# EAGLE design openmv3 (EAGLE 6.1)
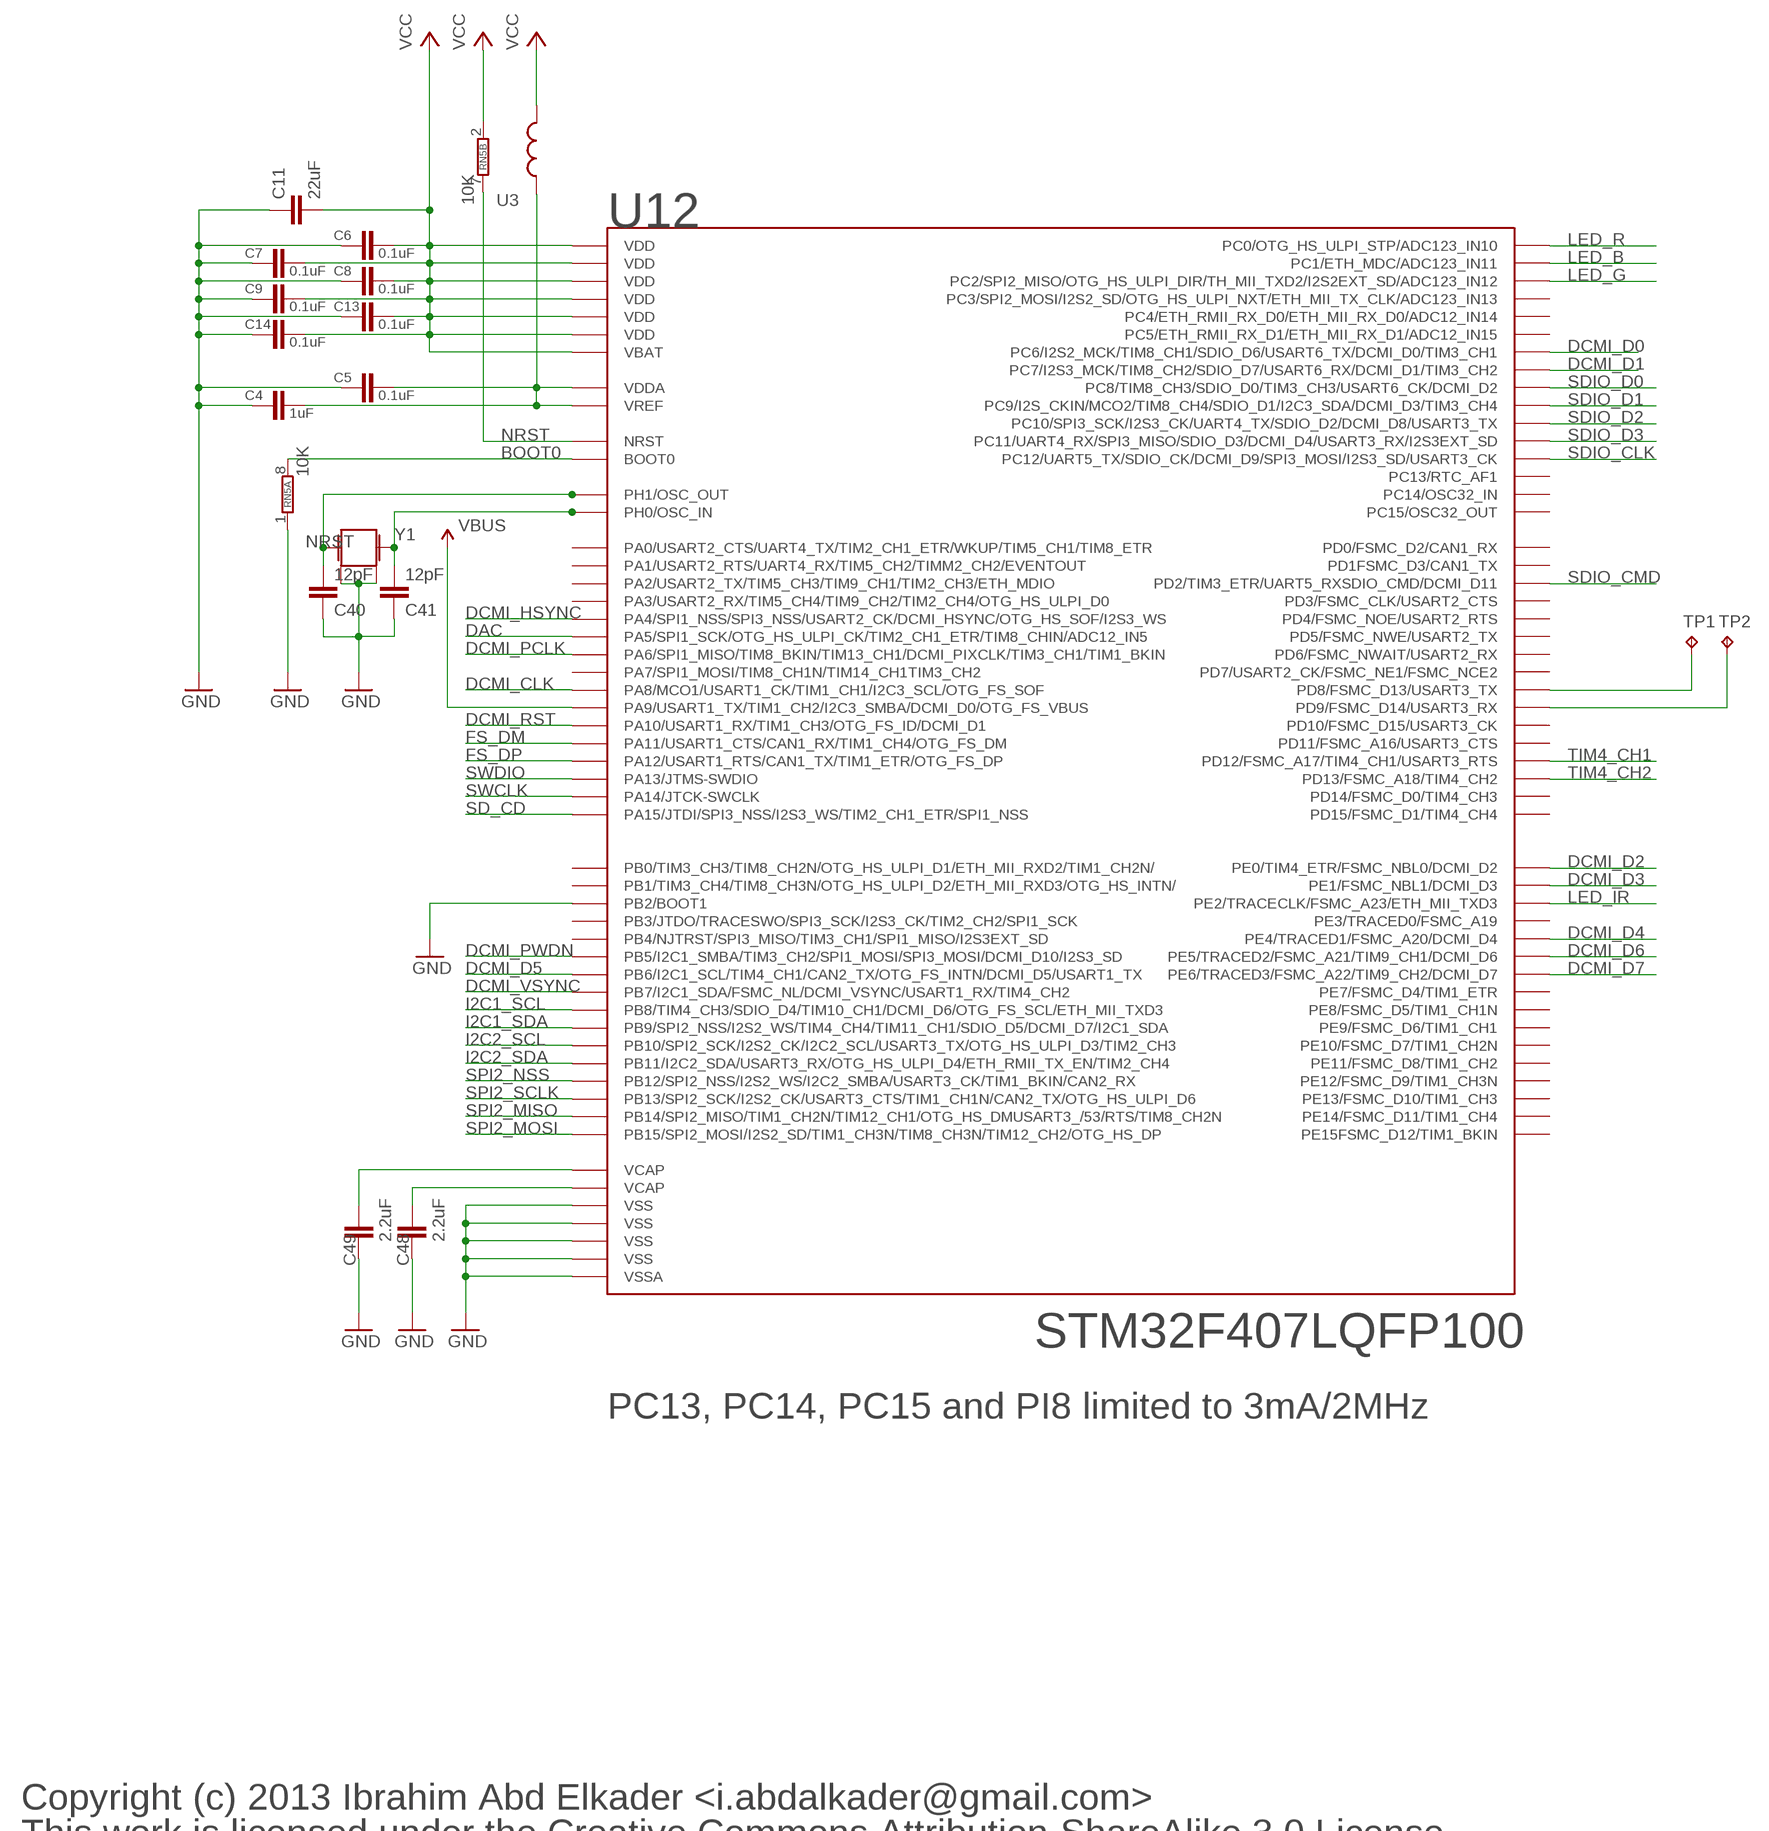
[diagram p0: schematic, sheet 1, part 1 of 2]
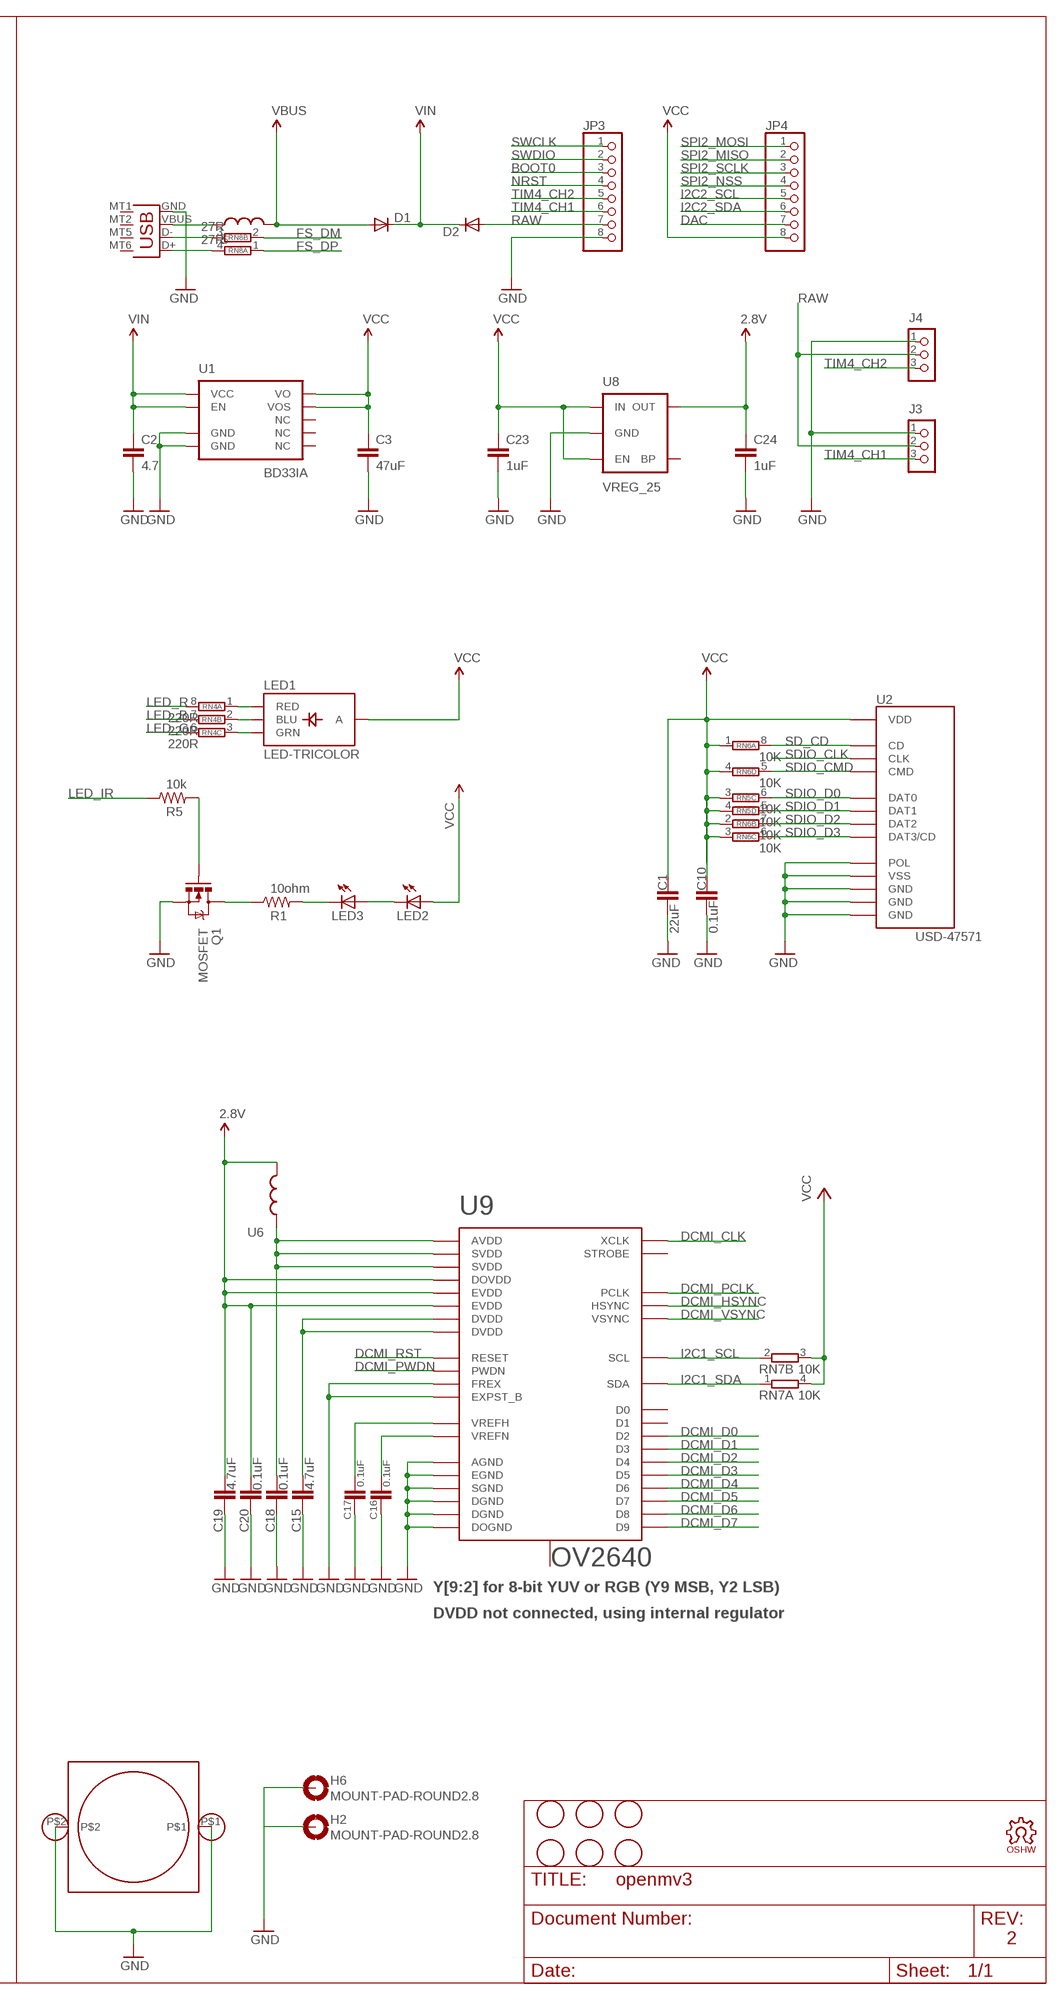
[diagram p1: schematic, sheet 1, part 2 of 2]

## Parts
C1  22uF  CAP0805  [0805]
C2  4.7  CAP0603-CAP  [0603-CAP]
C3  47uF  CAP1206  [1206]
C4  1uF  CAP0603-CAP  [0603-CAP]
C5  0.1uF  CAP0603-CAP  [0603-CAP]
C6  0.1uF  CAP0603-CAP  [0603-CAP]
C7  0.1uF  CAP0603-CAP  [0603-CAP]
C8  0.1uF  CAP0603-CAP  [0603-CAP]
C9  0.1uF  CAP0603-CAP  [0603-CAP]
C10  0.1uF  CAP0603-CAP  [0603-CAP]
C11  22uF  CAP0805  [0805]
C13  0.1uF  CAP0603-CAP  [0603-CAP]
C14  0.1uF  CAP0603-CAP  [0603-CAP]
C15  4.7uF  CAP0603-CAP  [0603-CAP]
C16  0.1uF  CAP0603-CAP  [0603-CAP]
C17  0.1uF  CAP0603-CAP  [0603-CAP]
C18  0.1uF  CAP0603-CAP  [0603-CAP]
C19  4.7uF  CAP0603-CAP  [0603-CAP]
C20  0.1uF  CAP0603-CAP  [0603-CAP]
C23  1uF  CAP0603-CAP  [0603-CAP]
C24  1uF  CAP0603-CAP  [0603-CAP]
C40  12pF  CAP0603-CAP  [0603-CAP]
C41  12pF  CAP0603-CAP  [0603-CAP]
C48  2.2uF  CAP0603-CAP  [0603-CAP]
C49  2.2uF  CAP0603-CAP  [0603-CAP]
D1  DIODESOD  [SOD-323]
D2  DIODESOD  [SOD-323]
H2  MOUNT-PAD-ROUND2.8  [2,8-PAD]
H6  MOUNT-PAD-ROUND2.8  [2,8-PAD]
J3  CON_HEADER_1X03  [M1X3_SMD]
J4  CON_HEADER_1X03  [M1X3_SMD]
JP3  PINHD-1X8  [1X08]
JP4  PINHD-1X8  [1X08]
LED1  LED-TRICOLOR  [LED-TRICOLOR-SMD]
LED2  LED3MM  [LED3MM]
LED3  LED3MM  [LED3MM]
LOGO1  OSHW_LOGO_FILLX0150-NT  [OSHW_FILLX150_NOTEXT]
Q1  MOSFET  MOSFET-NCHANNELSMD  [SOT23-3]
R1  10ohm  RESISTOR0603-RES  [0603-RES]
R5  10k  RESISTOR0603-RES  [0603-RES]
RN4  220R  4R-NEXBV8V  [EXBV8V]
RN5  10K  4R-NEXBV8V  [EXBV8V]
RN6  10K  4R-NEXBV8V  [EXBV8V]
RN7  10K  2R-NEXBV4V  [EXBV4V]
RN8  27R  2R-NEXBV4V  [EXBV4V]
TP1  TPTP12R  [TP12R]
TP2  TPTP12R  [TP12R]
U1  BD33IA  [HTSOP-J8]
U2  USD-47571  [USD-47571]
U3  INDUCTOR0603  [0603]
U6  INDUCTOR0603  [0603]
U7  INDUCTOR0603  [0603]
U8  VREG_25  V_REG_LDOSMD  [SOT23-5]
U9  OV2640  [CSP2]
U12  STM32F407LQFP100  [LQFP100]
U$1  LENSMOUNT20MM  [LENSMOUNT-20MM]
U$14  FIDUCIAL  [FIDUCIAL_1MM]
U$15  FIDUCIAL  [FIDUCIAL_1MM]
U$16  FIDUCIAL  [FIDUCIAL_1MM]
U$17  FIDUCIAL  [FIDUCIAL_1MM]
U$19  FIDUCIAL  [FIDUCIAL_1MM]
U$20  FIDUCIAL  [FIDUCIAL_1MM]
X2  USB-MICROB  [USB-MICROB]
Y1  CRYSTAL2.5X2.0  [CRYSTAL-2.5X2.0]

## Nets
2.8V: C19.1 C20.1 C24.1 U6.2 U8.5(OUT) U9.B1(DOVDD) U9.F1(EVDD) U9.G1(EVDD)
BOOT0: JP3.3 RN5.8 U12.94(BOOT0)
DAC: JP4.7 U12.30(PA5/SPI1_SCK/OTG_HS_ULPI_CK/TIM2_CH1_ETR/TIM8_CHIN/ADC12_IN5)
DCMI_CLK: U9.C4(XCLK) U12.67(PA8/MCO1/USART1_CK/TIM1_CH1/I2C3_SCL/OTG_FS_SOF)
DCMI_D0: U9.F3(D2) U12.63(PC6/I2S2_MCK/TIM8_CH1/SDIO_D6/USART6_TX/DCMI_D0/TIM3_CH1)
DCMI_D1: U9.G3(D3) U12.64(PC7/I2S3_MCK/TIM8_CH2/SDIO_D7/USART6_RX/DCMI_D1/TIM3_CH2)
DCMI_D2: U9.F4(D4) U12.97(PE0/TIM4_ETR/FSMC_NBL0/DCMI_D2)
DCMI_D3: U9.G4(D5) U12.98(PE1/FSMC_NBL1/DCMI_D3)
DCMI_D4: U9.E5(D6) U12.3(PE4/TRACED1/FSMC_A20/DCMI_D4)
DCMI_D5: U9.G5(D7) U12.92(PB6/I2C1_SCL/TIM4_CH1/CAN2_TX/OTG_FS_INTN/DCMI_D5/USART1_TX)
DCMI_D6: U9.F5(D8) U12.4(PE5/TRACED2/FSMC_A21/TIM9_CH1/DCMI_D6)
DCMI_D7: U9.G6(D9) U12.5(PE6/TRACED3/FSMC_A22/TIM9_CH2/DCMI_D7)
DCMI_HSYNC: U9.C3(HSYNC) U12.29(PA4/SPI1_NSS/SPI3_NSS/USART2_CK/DCMI_HSYNC/OTG_HS_SOF/I2S3_WS)
DCMI_PCLK: U9.E3(PCLK) U12.31(PA6/SPI1_MISO/TIM8_BKIN/TIM13_CH1/DCMI_PIXCLK/TIM3_CH1/TIM1_BKIN)
DCMI_PWDN: U9.B6(PWDN) U12.91(PB5/I2C1_SMBA/TIM3_CH2/SPI1_MOSI/SPI3_MOSI/DCMI_D10/I2S3_SD)
DCMI_RST: U9.C6(RESET) U12.69(PA10/USART1_RX/TIM1_CH3/OTG_FS_ID/DCMI_D1)
DCMI_VSYNC: U9.D2(VSYNC) U12.93(PB7/I2C1_SDA/FSMC_NL/DCMI_VSYNC/USART1_RX/TIM4_CH2)
FS_DM: RN8.2 U12.70(PA11/USART1_CTS/CAN1_RX/TIM1_CH4/OTG_FS_DM)
FS_DP: RN8.1 U12.71(PA12/USART1_RTS/CAN1_TX/TIM1_ETR/OTG_FS_DP)
GND: C1.2 C2.2 C3.2 C4.2 C5.2 C6.2 C7.2 C8.2 C9.2 C10.2 C11.1 C13.2 C14.2 C15.2 C16.2 C17.2 C18.2 C19.2 C20.2 C23.2 C24.2 C40.1 C41.1 C48.2 C49.2 H2.B2,8(MOUNT) H6.B2,8(MOUNT) J3.1 J4.1 JP3.8 Q1.2(S) RN5.1 U1.3(GND) U1.P$1(GND) U2.G$1(GND) U2.G$2(GND) U2.G$3(GND) U2.G$4(POL) U2.P$6(VSS) U8.2(GND) U9.A1(DOGND) U9.A2(EXPST_B) U9.A3(AGND) U9.A4(SGND) U9.B2(FREX) U9.E4(EGND) U9.E6(DGND) U9.G2(DGND) U12.10(VSS) U12.20(VSSA) U12.27(VSS) U12.37(PB2/BOOT1) U12.74(VSS) U12.99(VSS) U$1.P$1 U$1.P$2 X2.GND Y1.2 Y1.4
I2C1_SCL: RN7.2 U9.C2(SCL) U12.95(PB8/TIM4_CH3/SDIO_D4/TIM10_CH1/DCMI_D6/OTG_FS_SCL/ETH_MII_TXD3)
I2C1_SDA: RN7.1 U9.C1(SDA) U12.96(PB9/SPI2_NSS/I2S2_WS/TIM4_CH4/TIM11_CH1/SDIO_D5/DCMI_D7/I2C1_SDA)
I2C2_SCL: JP4.5 U12.47(PB10/SPI2_SCK/I2S2_CK/I2C2_SCL/USART3_TX/OTG_HS_ULPI_D3/TIM2_CH3)
I2C2_SDA: JP4.6 U12.48(PB11/I2C2_SDA/USART3_RX/OTG_HS_ULPI_D4/ETH_RMII_TX_EN/TIM2_CH4)
LED_B: RN4.7 U12.16(PC1/ETH_MDC/ADC123_IN11)
LED_G: RN4.6 U12.17(PC2/SPI2_MISO/OTG_HS_ULPI_DIR/TH_MII_TXD2/I2S2EXT_SD/ADC123_IN12)
LED_IR: R5.1 U12.1(PE2/TRACECLK/FSMC_A23/ETH_MII_TXD3)
LED_R: RN4.8 U12.15(PC0/OTG_HS_ULPI_STP/ADC123_IN10)
N$1: C17.1 U9.C5(VREFH)
N$2: C40.2 U12.13(PH1/OSC_OUT) Y1.3
N$3: C16.1 U9.A5(VREFN)
N$4: C41.2 U12.12(PH0/OSC_IN) Y1.1
N$5: Q1.1(G) R5.2
N$6: C15.1 U9.F2(DVDD) U9.F6(DVDD)
N$7: U7.1 X2.VBUS
N$8: LED1.R(RED) RN4.1
N$9: LED1.G(GRN) RN4.3
N$10: LED3.K(C) R1.2
N$11: LED1.B(BLU) RN4.2
N$12: C4.1 C5.1 U3.1 U12.21(VREF) U12.22(VDDA)
N$13: C18.1 U6.1 U9.B3(AVDD) U9.B4(SVDD) U9.B5(SVDD)
N$14: Q1.3(D) R1.1
N$15: RN8.3 X2.D-
N$16: LED2.K(C) LED3.A
N$17: RN8.4 X2.D+
N$19: TP1.TP U12.55(PD8/FSMC_D13/USART3_TX)
N$20: TP2.TP U12.56(PD9/FSMC_D14/USART3_RX)
NRST: JP3.4 RN5.7 U12.14(NRST)
RAW: D2.2(A) J3.2 J4.2 JP3.7
SD_CD: RN6.8 U2.G$5(CD) U12.77(PA15/JTDI/SPI3_NSS/I2S3_WS/TIM2_CH1_ETR/SPI1_NSS)
SDIO_CLK: U2.P$5(CLK) U12.80(PC12/UART5_TX/SDIO_CK/DCMI_D9/SPI3_MOSI/I2S3_SD/USART3_CK)
SDIO_CMD: RN6.5 U2.P$3(CMD) U12.83(PD2/TIM3_ETR/UART5_RXSDIO_CMD/DCMI_D11)
SDIO_D0: RN5.6 U2.P$7(DAT0) U12.65(PC8/TIM8_CH3/SDIO_D0/TIM3_CH3/USART6_CK/DCMI_D2)
SDIO_D1: RN5.5 U2.P$8(DAT1) U12.66(PC9/I2S_CKIN/MCO2/TIM8_CH4/SDIO_D1/I2C3_SDA/DCMI_D3/TIM3_CH4)
SDIO_D2: RN6.7 U2.P$1(DAT2) U12.78(PC10/SPI3_SCK/I2S3_CK/UART4_TX/SDIO_D2/DCMI_D8/USART3_TX)
SDIO_D3: RN6.6 U2.P$2(DAT3/CD) U12.79(PC11/UART4_RX/SPI3_MISO/SDIO_D3/DCMI_D4/USART3_RX/I2S3EXT_SD)
SPI2_MISO: JP4.2 U12.53(PB14/SPI2_MISO/TIM1_CH2N/TIM12_CH1/OTG_HS_DMUSART3_/53/RTS/TIM8_CH2N)
SPI2_MOSI: JP4.1 U12.54(PB15/SPI2_MOSI/I2S2_SD/TIM1_CH3N/TIM8_CH3N/TIM12_CH2/OTG_HS_DP)
SPI2_NSS: JP4.4 U12.51(PB12/SPI2_NSS/I2S2_WS/I2C2_SMBA/USART3_CK/TIM1_BKIN/CAN2_RX)
SPI2_SCLK: JP4.3 U12.52(PB13/SPI2_SCK/I2S2_CK/USART3_CTS/TIM1_CH1N/CAN2_TX/OTG_HS_ULPI_D6)
SWCLK: JP3.1 U12.76(PA14/JTCK-SWCLK)
SWDIO: JP3.2 U12.72(PA13/JTMS-SWDIO)
TIM4_CH1: J3.3 JP3.6 U12.59(PD12/FSMC_A17/TIM4_CH1/USART3_RTS)
TIM4_CH2: J4.3 JP3.5 U12.60(PD13/FSMC_A18/TIM4_CH2)
VBUS: D1.2(A) U7.2 U12.68(PA9/USART1_TX/TIM1_CH2/I2C3_SMBA/DCMI_D0/OTG_FS_VBUS)
VCAP1: C49.1 U12.49(VCAP)
VCAP2: C48.1 U12.73(VCAP)
VCC: C1.1 C3.1 C6.1 C7.1 C8.1 C9.1 C10.1 C11.2 C13.1 C14.1 C23.1 JP4.8 LED1.A LED2.A RN5.2 RN5.3 RN5.4 RN6.1 RN6.2 RN6.3 RN6.4 RN7.3 RN7.4 U1.1(VO) U1.2(VOS) U2.P$4(VDD) U3.2 U8.1(IN) U8.3(EN) U12.6(VBAT) U12.11(VDD) U12.19(VDD) U12.28(VDD) U12.50(VDD) U12.75(VDD) U12.100(VDD)
VIN: C2.1 D1.1(C) D2.1(C) U1.5(EN) U1.8(VCC)
Unconnected: RN4.4 RN4.5 U1.4(NC) U1.6(NC) U1.7(NC) U8.4(BP) U9.A6(STROBE) U9.D6(NC) U9.E1(D1) U9.E2(D0) U12.2(PE3/TRACED0/FSMC_A19) U12.7(PC13/RTC_AF1) U12.8(PC14/OSC32_IN) U12.9(PC15/OSC32_OUT) U12.18(PC3/SPI2_MOSI/I2S2_SD/OTG_HS_ULPI_NXT/ETH_MII_TX_CLK/ADC123_IN13) U12.23(PA0/USART2_CTS/UART4_TX/TIM2_CH1_ETR/WKUP/TIM5_CH1/TIM8_ETR) U12.24(PA1/USART2_RTS/UART4_RX/TIM5_CH2/TIMM2_CH2/EVENTOUT) U12.25(PA2/USART2_TX/TIM5_CH3/TIM9_CH1/TIM2_CH3/ETH_MDIO) U12.26(PA3/USART2_RX/TIM5_CH4/TIM9_CH2/TIM2_CH4/OTG_HS_ULPI_D0) U12.32(PA7/SPI1_MOSI/TIM8_CH1N/TIM14_CH1TIM3_CH2) U12.33(PC4/ETH_RMII_RX_D0/ETH_MII_RX_D0/ADC12_IN14) U12.34(PC5/ETH_RMII_RX_D1/ETH_MII_RX_D1/ADC12_IN15) U12.35(PB0/TIM3_CH3/TIM8_CH2N/OTG_HS_ULPI_D1/ETH_MII_RXD2/TIM1_CH2N/) U12.36(PB1/TIM3_CH4/TIM8_CH3N/OTG_HS_ULPI_D2/ETH_MII_RXD3/OTG_HS_INTN/) U12.38(PE7/FSMC_D4/TIM1_ETR) U12.39(PE8/FSMC_D5/TIM1_CH1N) U12.40(PE9/FSMC_D6/TIM1_CH1) U12.41(PE10/FSMC_D7/TIM1_CH2N) U12.42(PE11/FSMC_D8/TIM1_CH2) U12.43(PE12/FSMC_D9/TIM1_CH3N) U12.44(PE13/FSMC_D10/TIM1_CH3) U12.45(PE14/FSMC_D11/TIM1_CH4) U12.46(PE15FSMC_D12/TIM1_BKIN) U12.57(PD10/FSMC_D15/USART3_CK) U12.58(PD11/FSMC_A16/USART3_CTS) U12.61(PD14/FSMC_D0/TIM4_CH3) U12.62(PD15/FSMC_D1/TIM4_CH4) U12.81(PD0/FSMC_D2/CAN1_RX) U12.82(PD1FSMC_D3/CAN1_TX) U12.84(PD3/FSMC_CLK/USART2_CTS) U12.85(PD4/FSMC_NOE/USART2_RTS) U12.86(PD5/FSMC_NWE/USART2_TX) U12.87(PD6/FSMC_NWAIT/USART2_RX) U12.88(PD7/USART2_CK/FSMC_NE1/FSMC_NCE2) U12.89(PB3/JTDO/TRACESWO/SPI3_SCK/I2S3_CK/TIM2_CH2/SPI1_SCK) U12.90(PB4/NJTRST/SPI3_MISO/TIM3_CH1/SPI1_MISO/I2S3EXT_SD) X2.MT1(GND1) X2.MT2(GND2) X2.MT5(GND3) X2.MT6(GND4)

## Notes on the sheet
- Y[9:2] for 8-bit YUV or RGB (Y9 MSB, Y2 LSB)
- PC13, PC14, PC15 and PI8 limited to 3mA/2MHz
- DVDD not connected, using internal regulator
- Copyright (c) 2013 Ibrahim Abd Elkader <i.abdalkader@gmail.com>
- This work is licensed under the Creative Commons Attribution-ShareAlike 3.0 License.
- To view a copy of this license, visit http://creativecommons.org/licenses/by-sa/3.0/ | 2

## Library data of the parts
C1-C11 C13-C20 C23 C24 C40 C41 C48 C49 = sfe:CAP: Capacitor Standard 0603 ceramic capacitor, and 0.1" leaded capacitor.
D1 D2 = sfe:DIODE: Diode These are standard reverse protection diodes and small signal diodes. SMA package can handle up to about 1A. SOD-323 can handle about 200mA. What the SOD-323 package when ordering, there are some mfgs out there that are 5-pin packages.
H2 H6 = holes:MOUNT-PAD-ROUND: MOUNTING PAD, round
J3 J4 = dp_devices:CON_HEADER_1X03
JP3 JP4 = pinhead:PINHD-1X8: PIN HEADER
LED1 = sfe:LED-TRICOLOR: Tri-Color LED SMD Proven layout and schematic for triple color LED in SMD package - common anode. Spark Fun Electronics SKU : COM-07844
LED2 LED3 = sfe:LED: LEDs Standard schematic elements and footprints for 5mm, 3mm, 1206, and 0603 sized LEDs. 5mm - Spark Fun Electronics SKU : COM-00529 (and others)
LOGO1 = iofault:OSHW_LOGO_FILL
Q1 = sfe:MOSFET-NCHANNEL
R1 R5 = sfe:RESISTOR: Resistor Basic schematic elements and footprints for 0603, 1206, and PTH resistors.
RN4-RN6 = resistor-dil:4R-N: Array Chip Resistor Source: RS Component / Phycomp; OC_FARNELL: unknown; OC_NEWARK: unknown
RN7 RN8 = resistor-dil:2R-N: Array Chip Resistor Source: Panasonic; OC_FARNELL: unknown; OC_NEWARK: unknown
TP1 TP2 = testpad:TP: Test pad
U1 = mux:BD33IA
U2 = mux:USD-47571
U3 U6 U7 = sfe:INDUCTOR: Inductors Basic Inductor/Choke - 0603 and 1206. Footprints are not proven and vary greatly between part numbers.
U8 = sfe:V_REG_LDO: Voltage Regulator LDO Standard 150mA LDO voltage regulator in SOT-23 layout. Micrel part MIC5205. BP (by-pass) pin is used to lower output noise with 470pF cap.
U9 = omnivision:OV2640
U12 = mux:STM32F407
U$1 = omnivision:LENSMOUNT
U$14-U$17 U$19 U$20 = adafruit:FIDUCIAL: For use by pick and place machines to calibrate the vision/machine, 1mm By microbuilder.eu
X2 = sfe:USB: USB Connectors USB-B-PTH is fully proven SKU : PRT-00139 USB-miniB is fully proven SKU : PRT-00587 USB-A-PCB is untested. USB-A-H is throughly reviewed, but untested. Spark Fun Electronics SKU : PRT-00437 USB-B-SMT is throughly reviewed, but untested. Needs silkscreen touching up. USB-A-S has not been used/tested USB-MB-H has not been used/tested
Y1 = mux:CRYSTAL: Crystals Various standard crystals. Proven footprints. Spark Fun Electronics SKU : COM-00534

## Board
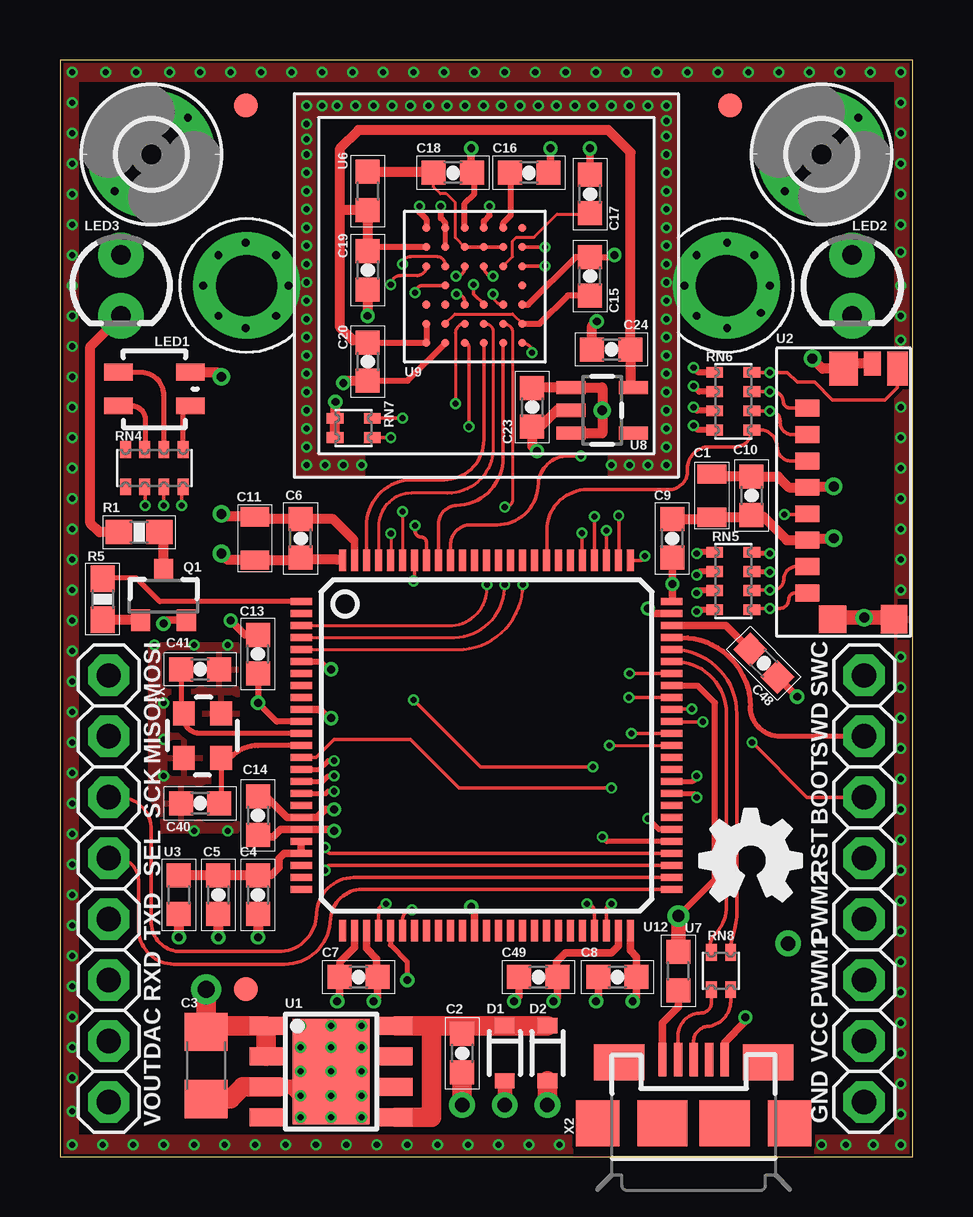
[diagram p2: board, top side]
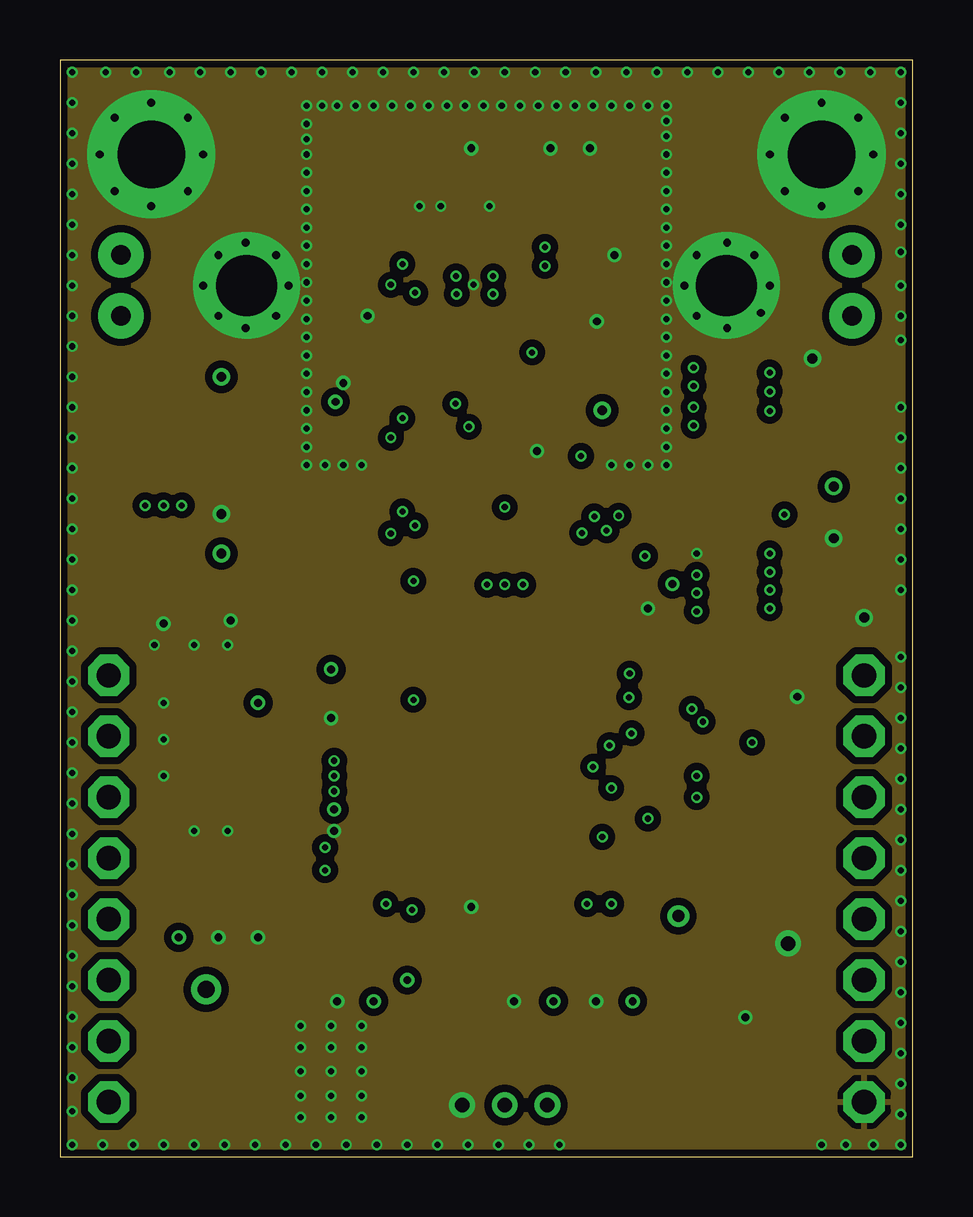
[diagram p3: board, inner layer GND]
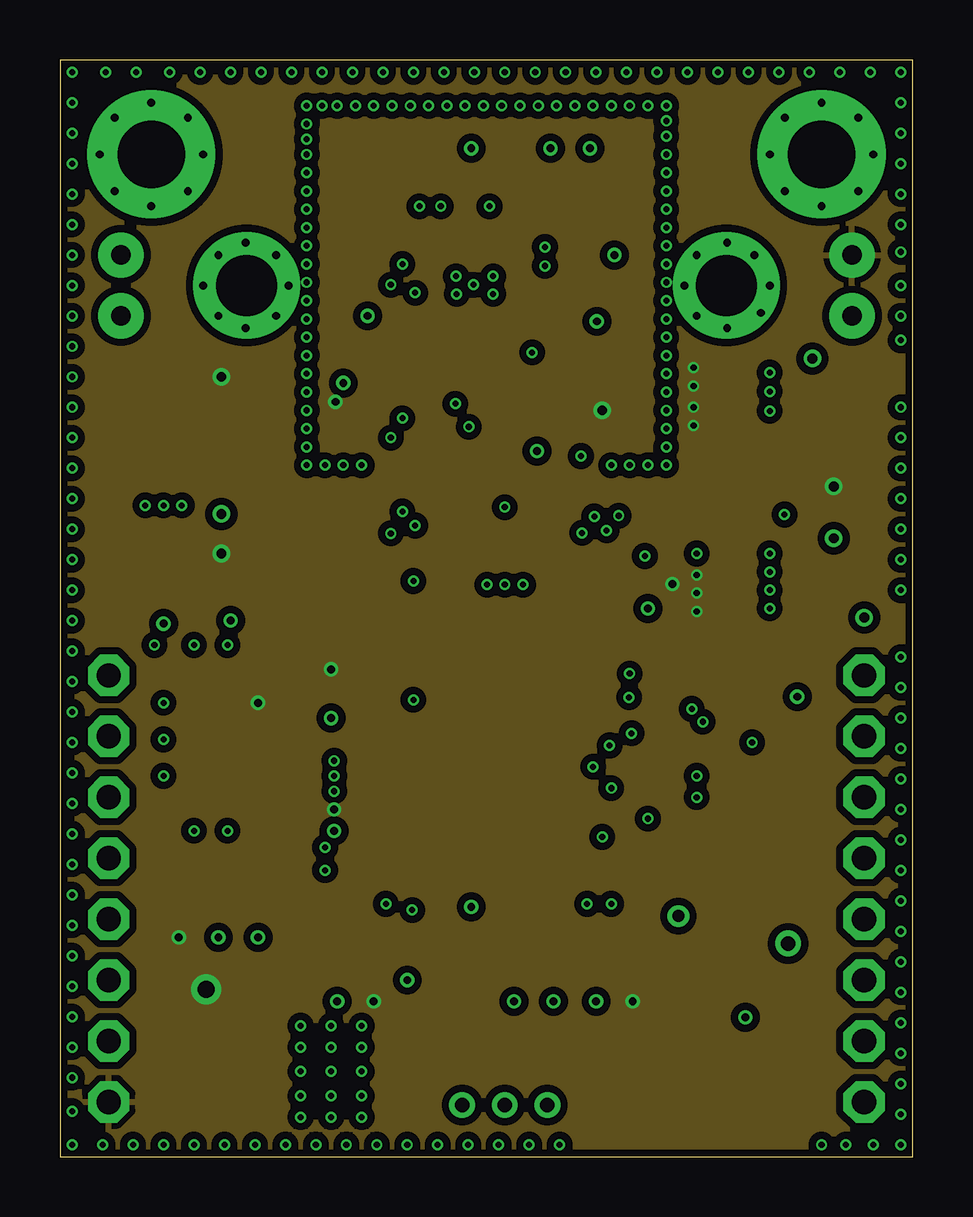
[diagram p4: board, inner layer VCC]
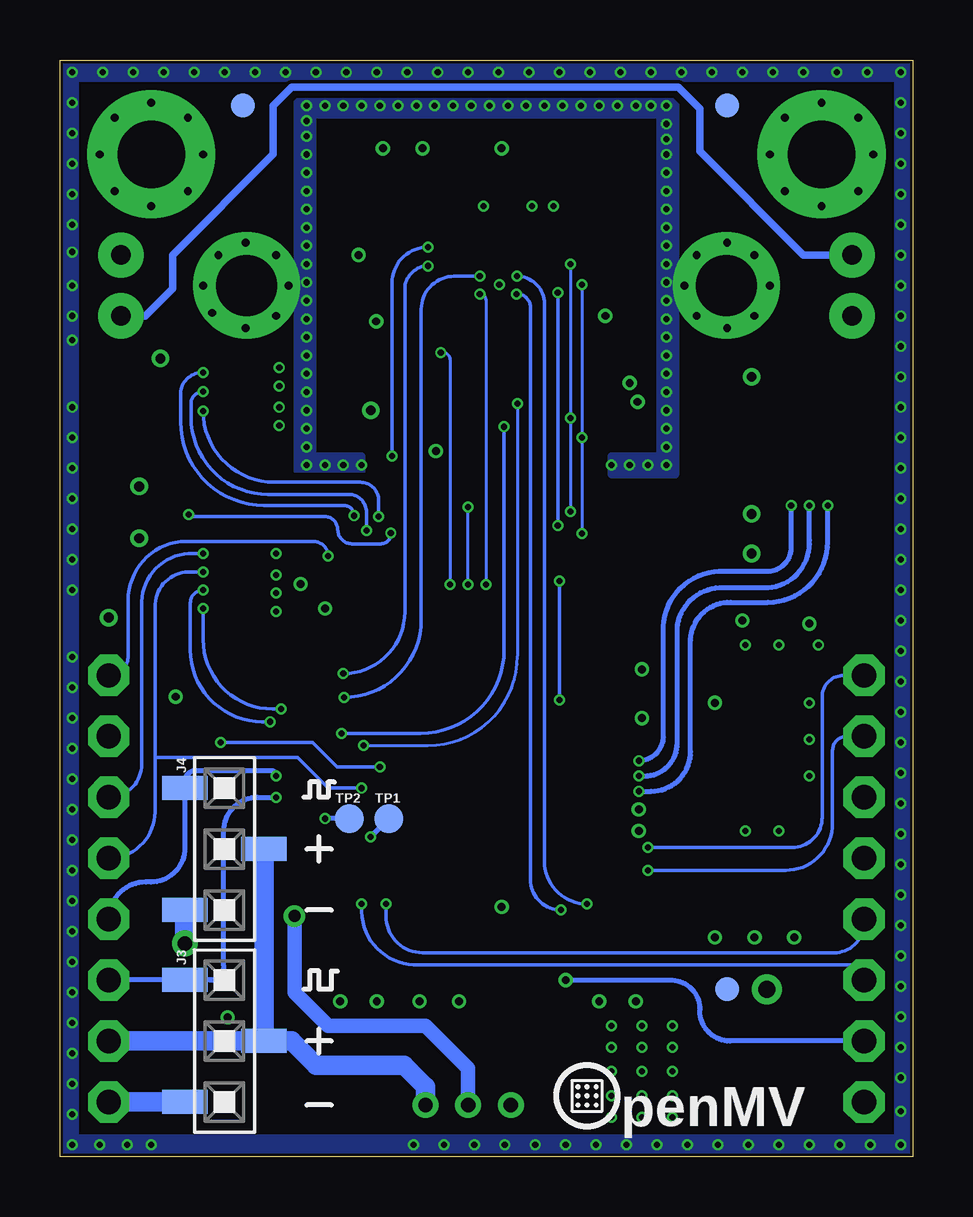
[diagram p5: board, bottom side, seen from below]

Size 35.56 x 45.72 mm. Coordinates in mm from the lower left corner, seen from the top.
Outline: 0,45.72 0,0 35.56,0 35.56,45.72 0,45.72
Copper layers (1*2+15*16): Top 0.035mm / dielectric 1.5mm / GND 0.035mm / dielectric 0.15mm / VCC 0.035mm / dielectric 0.2mm / Bottom 0.035mm
Design rules: minimum track width 5mil, minimum drill 10mil, track to track 6mil, track to pad 6mil, pad to pad 6mil, via to via 6mil, smd to smd 6mil, copper to edge 5mil, drill to drill 10mil, minimum pad ring 10mil, minimum via ring 4mil, stop-mask expansion 2mil, vias tented up to drill 30mil, thermal gap 10mil

### Footprints (pad centres in the part's own frame; a part is rotated, then mirrored left to right if it is on the bottom)
0805 = smd 0.8 x 1.2: 1 -0.9,0; 2 0.9,0
0603-CAP = smd 1 x 1: 1 -0.8,0; 2 0.8,0
1206 = smd 1.6 x 1.8: 1 -1.4,0; 2 1.4,0
SOD-323 = smd 0.63 x 0.83: 1 -1.15,0; 2 1.15,0
2,8-PAD = drill 2.8 pad 5.334: B2,8 0,0
M1X3_SMD = smd 1 x 1.9: 1 -2.54,1.65; 2 0,-1.65; 3 2.54,1.65
1X08 = drill 1.016 octagon: 1 -8.89,0; 2 -6.35,0; 3 -3.81,0; 4 -1.27,0; 5 1.27,0; 6 3.81,0; 7 6.35,0; 8 8.89,0
LED-TRICOLOR-SMD = smd 0.7 x 1.2: A 0.7,-1.5; B 0.7,1.5; G -0.7,1.5; R -0.7,-1.5
LED3MM = drill 0.813 pad 1.88: A -1.27,0; K 1.27,0
SOT23-3 = smd 0.8 x 0.9: 1 -0.95,-1; 2 0.95,-1; 3 0,1.1
0603-RES = smd 1.1 x 1: 1 -0.85,0; 2 0.85,0
EXBV8V = smd 0.45 x 0.7: 1 -1.2,-0.775; 2 -0.4,-0.775; 3 0.4,-0.775; 4 1.2,-0.775; 5 1.2,0.775; 6 0.4,0.775; 7 -0.4,0.775; 8 -1.2,0.775
EXBV4V = smd 0.45 x 0.7: 1 -0.4,-0.775; 2 0.4,-0.775; 3 0.4,0.775; 4 -0.4,0.775
TP12R = smd 1.2 x 1.2: TP 0,0
HTSOP-J8 = smd 0.75 x 1.4: 1 -1.905,-2.7; 2 -0.635,-2.7; 3 0.635,-2.7; 4 1.905,-2.7; 5 1.905,2.7; 6 0.635,2.7; 7 -0.635,2.7; 8 -1.905,2.7 | smd 4.4 x 3.2: P$1 0,0
USD-47571 = smd 1.15 x 1.15: G$1 -4.9,0.55 | smd 1.2 x 1.1: G$2 -4.9,-2 | smd 1.4 x 1.2: G$3 5.55,0.1 | smd 1 x 0.7: G$4 5.75,-1.1 | smd 1.4 x 0.85: G$5 5.55,-2.15 | smd 0.7 x 1: P$1 3.9,1.6; P$2 2.8,1.6; P$3 1.7,1.6; P$4 0.6,1.6; P$5 -0.5,1.6; P$6 -1.6,1.6; P$7 -2.7,1.6; P$8 -3.8,1.6
0603 = smd 1 x 1: 1 -0.8,0; 2 0.8,0
SOT23-5 = smd 0.55 x 1.2: 1 -0.95,-1.3; 2 0,-1.3; 3 0.95,-1.3; 4 0.95,1.3; 5 -0.95,1.3
CSP2 = smd 0.34 x 0.34: A1 -2,2.4; A2 -1.2,2.4; A3 -0.4,2.4; A4 0.4,2.4; A5 1.2,2.4; A6 2,2.4; B1 -2,1.6; B2 -1.2,1.6; B3 -0.4,1.6; B4 0.4,1.6; B5 1.2,1.6; B6 2,1.6; C1 -2,0.8; C2 -1.2,0.8; C3 -0.4,0.8; C4 0.4,0.8; C5 1.2,0.8; C6 2,0.8; D2 -1.2,0; D6 2,0; E1 -2,-0.8; E2 -1.2,-0.8; E3 -0.4,-0.8; E4 0.4,-0.8; E5 1.2,-0.8; E6 2,-0.8; F1 -2,-1.6; F2 -1.2,-1.6; F3 -0.4,-1.6; F4 0.4,-1.6; F5 1.2,-1.6; F6 2,-1.6; G1 -2,-2.4; G2 -1.2,-2.4; G3 -0.4,-2.4; G4 0.4,-2.4; G5 1.2,-2.4; G6 2,-2.4
LQFP100 = smd 0.9 x 0.3: 1 -7.72,6; 2 -7.72,5.5; 3 -7.72,5; 4 -7.72,4.5; 5 -7.72,4; 6 -7.72,3.5; 7 -7.72,3; 8 -7.72,2.5; 9 -7.72,2; 10 -7.72,1.5; 11 -7.72,1; 12 -7.72,0.5; 13 -7.72,0; 14 -7.72,-0.5; 15 -7.72,-1; 16 -7.72,-1.5; 17 -7.72,-2; 18 -7.72,-2.5; 19 -7.72,-3; 20 -7.72,-3.5; 21 -7.72,-4; 22 -7.72,-4.5; 23 -7.72,-5; 24 -7.72,-5.5; 25 -7.72,-6; 51 7.72,-6; 52 7.72,-5.5; 53 7.72,-5; 54 7.72,-4.5; 55 7.72,-4; 56 7.72,-3.5; 57 7.72,-3; 58 7.72,-2.5; 59 7.72,-2; 60 7.72,-1.5; 61 7.72,-1; 62 7.72,-0.5; 63 7.72,0; 64 7.72,0.5; 65 7.72,1; 66 7.72,1.5; 67 7.72,2; 68 7.72,2.5; 69 7.72,3; 70 7.72,3.5; 71 7.72,4; 72 7.72,4.5; 73 7.72,5; 74 7.72,5.5; 75 7.72,6 | smd 0.3 x 0.9: 26 -6,-7.72; 27 -5.5,-7.72; 28 -5,-7.72; 29 -4.5,-7.72; 30 -4,-7.72; 31 -3.5,-7.72; 32 -3,-7.72; 33 -2.5,-7.72; 34 -2,-7.72; 35 -1.5,-7.72; 36 -1,-7.72; 37 -0.5,-7.72; 38 0,-7.72; 39 0.5,-7.72; 40 1,-7.72; 41 1.5,-7.72; 42 2,-7.72; 43 2.5,-7.72; 44 3,-7.72; 45 3.5,-7.72; 46 4,-7.72; 47 4.5,-7.72; 48 5,-7.72; 49 5.5,-7.72; 50 6,-7.72; 76 6,7.72; 77 5.5,7.72; 78 5,7.72; 79 4.5,7.72; 80 4,7.72; 81 3.5,7.72; 82 3,7.72; 83 2.5,7.72; 84 2,7.72; 85 1.5,7.72; 86 1,7.72; 87 0.5,7.72; 88 0,7.72; 89 -0.5,7.72; 90 -1,7.72; 91 -1.5,7.72; 92 -2,7.72; 93 -2.5,7.72; 94 -3,7.72; 95 -3.5,7.72; 96 -4,7.72; 97 -4.5,7.72; 98 -5,7.72; 99 -5.5,7.72; 100 -6,7.72
LENSMOUNT-20MM = drill 2.54 pad 4.445: P$1 -10,0; P$2 10,0
FIDUCIAL_1MM = smd 1 x 1: 1 0,0
USB-MICROB = smd 0.35 x 1.4: D+ 0,2.65; D- -0.65,2.65; GND 1.3,2.65; ID 0.65,2.65; VBUS -1.3,2.65 | smd 1.8 x 1.9: MT1 -4,0; MT2 4,0 | smd 2.1 x 1.5: MT3 3.1,2.55; MT4 -3.1,2.55 | smd 2.1 x 1.9: MT5 -1.3,0; MT6 1.3,0
CRYSTAL-2.5X2.0 = smd 1 x 0.9: 1 -0.95,-0.8; 2 0.9,-0.8; 3 0.9,0.75; 4 -0.95,0.75

### Placement (x,y rotation side)
C1  27.18,27.56 270 top
C2  16.76,4.32 270 top
C3  6.1,3.81 270 top
C4  8.26,10.92 270 top
C5  6.6,10.92 270 top
C6  10.03,25.78 90 top
C7  12.45,7.49 180 top
C8  23.24,7.49 180 top
C9  25.53,25.78 90 top
C10  28.83,27.56 270 top
C11  8.13,25.78 270 top
C13  8.26,20.95 90 top
C14  8.26,14.22 270 top
C15  22.1,36.7 90 top
C16  19.56,41.02 0 top
C17  22.1,40.13 90 top
C18  16.38,41.02 0 top
C19  12.83,36.96 270 top
C20  12.83,33.15 270 top
C23  19.68,31.24 270 top
C24  22.99,33.66 180 top
C40  5.84,14.73 0 top
C41  5.84,20.32 180 top
C48  29.34,20.57 315 top
C49  19.94,7.49 180 top
D1  18.54,4.32 270 top
D2  20.32,4.32 270 top
H2  3.81,41.78 90 top
H6  31.75,41.78 270 top
J3  28.7,4.83 90 bottom
J4  28.7,12.83 90 bottom
JP3  33.53,11.18 270 top
JP4  2.03,11.18 270 top
LED1  3.94,32 90 top
LED2  33.02,36.32 270 top
LED3  2.54,36.32 270 top
LOGO1  26.67,10.67 0 top
Q1  4.32,23.37 0 top
R1  3.3,26.04 180 top
R5  1.78,23.24 270 top
RN4  3.94,28.7 180 top
RN5  28.07,24 270 top
RN6  28.07,31.5 270 top
RN7  12.24,30.38 90 top
RN8  27.56,7.75 180 top
TP1  21.84,14.1 0 bottom
TP2  23.5,14.1 0 bottom
U1  11.3,3.56 270 top
U2  32.77,27.3 90 top
U3  4.95,10.92 270 top
U6  12.83,40.26 270 top
U7  25.78,7.75 90 top
U8  22.61,31.11 270 top
U9  17.27,36.32 0 top
U12  17.78,17.14 0 top
U$1  17.78,36.32 0 top
U$14  27.94,43.81 0 top
U$15  7.75,6.99 270 bottom
U$16  27.94,43.81 0 bottom
U$17  7.75,6.99 90 top
U$19  7.75,43.81 0 bottom
U$20  7.75,43.81 0 top
X2  26.42,1.4 0 top
Y1  5.97,17.53 270 top

### Tracks (layer width: path | path; a pad name or v marks a point on that pad's centre or on a via)
2.8V
  Top 0.254: U9.F1 U9.G1 12.85,33.92 C20.1 | U9.B1 12.99,37.92 C19.1
  Top 0.406: 11.68,39.37 11.68,34.57 12.22,34.04 12.95,34.04 12.87,33.95 C20.1 | 11.68,39.37 11.68,42.04 12.45,42.8 22.86,42.8 23.79,41.87 C24.1 23.79,32.18 U8.5 | 11.68,39.37 11.77,39.46 U6.2 C19.1
BOOT0  (via drill 0.25)
  Top 0.152: v22.23,16.26 17.53,16.26 v14.73,19.05 | U12.94 14.78,24.05 arc-90 v14.73,24 | v28.85,17.27 31.14,14.99 JP3.3
  Top 0.203: v29.59,25.15 28.9,25.15 RN5.8
  Bottom 0.152: v22.23,16.26 24,16.26 25.02,17.27 v28.85,17.27 | v14.73,24 v14.73,19.05 | v29.59,25.15 30,25.15 arc-90 32.16,23.14 32.16,16.36 arc90 JP3.3
DAC  (via drill 0.33)
  Top 0.203: U12.30 13.78,8.83 14.48,8.13 v14.48,7.37
  Bottom 0.203: v14.48,7.37 10.03,7.37 arc90 8.89,6.1 arc-90 7.62,4.83 JP4.7
DCMI_CLK  (via drill 0.25)
  Top 0.152: v23.72,19.15 25.49,19.15 arc-90 U12.67 | U9.C4 17.67,37.09 arc90 v18.06,36.7
  Bottom 0.152: v23.72,19.15 arc-90 20.5,22.38 20.5,35.33 arc90 19.13,36.7 v18.06,36.7
DCMI_D0  (via drill 0.25)
  Top 0.127: U9.F3 U9.F3 arc90 16.48,34.34 v16.48,31.39 | v22.91,17.14 U12.63
  Bottom 0.127: v16.48,31.39 16.48,20.88 arc90 20.22,17.14 v22.91,17.14
DCMI_D1  (via drill 0.25)
  Top 0.127: 25.49,17.65 arc-90 U12.64
  Top 0.152: U9.G3 U9.G3 arc-90 17.04,33.76 v17.04,30.43 | v23.82,17.65 25.49,17.65 arc-90 U12.64
  Bottom 0.152: v17.04,30.43 17.04,21.13 arc90 20.52,17.65 v23.82,17.65
DCMI_D2
  Top 0.127: U9.F4 17.73,34.72 arc-90 18.06,34.42 18.06,29.54 arc-90 16.15,27.66 14.66,27.66 arc90 13.28,26.29 U12.97 arc-90 U12.97
DCMI_D3
  Top 0.127: U12.98 arc90 U12.98
  Top 0.152: U9.G4 17.67,29.89 arc-90 16,28.22 14.68,28.22 arc90 12.78,26.29 U12.98 arc90 U12.98
DCMI_D4  (via drill 0.25)
  Top 0.127: U12.3 16.35,22.14 arc90 v17.8,23.85 | v18.06,35.97 18.06,35.94 arc90 U9.E5
  Top 0.152: U9.E5
  Bottom 0.127: v18.06,35.97 18.03,35.97 arc90 17.8,35.71 v17.8,23.85
DCMI_D5
  Top 0.152: U9.G5 18.47,29.14 arc-90 16.51,27.15 arc90 15.78,26.32 U12.92
DCMI_D6  (via drill 0.25)
  Top 0.127: U12.4 16.44,21.64 arc90 v18.54,23.85 | U9.F5 18.52,34.72 arc-90 18.87,34.34 18.87,27.41 arc-90 v18.54,27.08
  Bottom 0.127: v18.54,23.85 v18.54,27.08
DCMI_D7  (via drill 0.25)
  Top 0.127: U12.5 16.57,21.14 arc90 v19.3,23.85 | U9.G6 19.29,33.92 arc-90 v19.68,33.53
  Bottom 0.127: v19.3,23.85 19.3,33.25 arc-90 19.58,33.53 v19.68,33.53
DCMI_HSYNC  (via drill 0.25)
  Top 0.152: U12.29 13.28,10.23 arc-90 v13.59,10.54 | U9.C3 16.87,37.06 arc-90 v16.51,36.7
  Bottom 0.152: v13.59,10.54 arc90 15.37,12.32 15.37,35.56 arc-90 v16.51,36.7
DCMI_PCLK  (via drill 0.25)
  Top 0.152: U9.E3 16.87,35.63 arc90 v16.54,35.97 | U12.31 14.28,9.89 arc-90 v14.68,10.29
  Bottom 0.152: v16.54,35.97 16.51,35.97 arc90 15.95,35.43 15.95,11.56 arc-90 v14.68,10.29
DCMI_PWDN  (via drill 0.25)
  Top 0.152: v20.22,37.92 U9.B6 | U9.B6 arc90 U9.B6 | U12.91 16.28,25.5 arc-90 17.12,26.34 18.21,26.34 arc90 19.94,28.07 arc-90 21.29,29.21 v21.72,29.21
  Bottom 0.152: v21.72,29.21 21.72,36.42 arc90 v20.22,37.92
DCMI_RST  (via drill 0.25)
  Top 0.152: U12.69 25.45,20.19 arc-90 25.4,20.14 v23.75,20.14 | v20.22,37.13 19.29,37.13 arc90 U9.C6
  Bottom 0.152: v23.75,20.14 arc-90 21.18,22.71 21.18,36.17 arc90 v20.22,37.13
DCMI_VSYNC  (via drill 0.25)
  Top 0.152: U9.D2 15.16,36.32 arc90 v14.81,36.02 | U12.93 15.28,25.61 arc90 15.04,25.83 arc-90 14.81,26.11 v14.81,26.31
  Bottom 0.152: v14.81,36.02 v14.81,26.31
FS_DM
  Top 0.152: U12.70 25.61,20.64 arc-90 27.79,18.49 27.79,10.46 arc-44 27.3,9.27 arc66 RN8.2
FS_DP
  Top 0.152: U12.71 25.54,21.14 arc-90 28.22,18.47 28.22,10.26 arc-17 28.07,9.27 arc19 RN8.1
GND  (via drill 0.25, 0.33, 0.41, 0.6)
  Top 0.152: U9.E4 17.67,35.54 17.25,35.97 v17.25,36.35
  Top 0.203: U9.B2 U9.A2
  Top 0.254: U9.A2 16.07,38.92 15.88,39.12 v15.88,39.62 | v14.99,39.62 14.99,39.37 15.27,39.08 U9.A1 | U9.A4 17.67,39.01 17.91,39.24 v17.91,39.62 | RN5.1 26.6,25.2 v26.54,25.15 | U9.E6 19.52,35.52 21.5,37.5 C15.2 23.02,37.5 v23.11,37.59 | C20.2 14.5,32.35 U9.G2 | U9.A3 16.87,39.73 17.27,40.13 17.27,40.93 C18.2
  Top 0.305: U12.37 17.28,10.28 v17.14,10.41 | U12.10 10.82,18.64 11.18,18.29 v11.3,18.29 | C48.2 v30.73,19.18 | U12.74 24.73,22.64 v24.51,22.86 | U12.27 12.28,8.72 11.68,8.13 11.68,7.53 C7.2 11.65,6.57 v11.56,6.48 | C49.2 19.14,6.69 v18.92,6.48 | C8.2 22.44,6.57 v22.35,6.48 | C14.2 8.34,13.34 8.89,13.34 9.2,13.64 U12.20 11.37,13.64 v11.43,13.59 | Q1.2 4.46,22.37 v4.32,22.23 | C17.2 v22.1,42.04 | C18.2 17.14,41.02 v17.14,42.04 | C16.2 20.45,41.02 v20.45,42.04 | C13.2 7.71,21.75 v7.11,22.35 | X2.GND 27.72,4.78 28.57,5.64 v28.57,5.82 | U12.99 12.28,25.69 arc90 12.19,25.78
  Top 0.406: v19.89,29.41 19.68,29.62 C23.2 20.03,30.44 20.7,31.11 U8.2 | C4.2 v8.26,9.14 | C5.2 v6.6,9.14 | C9.2 27.1,26.58 C1.2 28.73,26.66 C10.2 28.92,26.67 29.34,26.67 30.3,25.7 U2.P$6 31.24,25.78 v32.26,25.78 | C19.2 v12.83,35.05 | v11.81,32.26 11.9,32.35 C20.2 | C24.2 22.19,34.63 v22.38,34.82 | U2.G$4 32.87,33.05 U2.G$3 31.79,32.85 v31.37,33.27 | v6.73,26.8 6.85,26.68 C11.1 8.23,26.58 C6.2 11.39,26.58 12.19,25.78
  Top 0.61: U2.G$2 34.69,22.48 v33.53,22.48 32.29,22.48 arc90 U2.G$1 | U1.3 9.14,2.92 9.65,2.92 v10.03,2.54
  Top 0.813: C2.2 v16.76,2.16 | C3.2 7.11,2.41 7.62,2.92 9.14,2.92
  Bottom 0.813: J3.1 JP3.8 | J4.1 v30.35,8.89
  other vias: 2.29,43.31 1.65,41.78 2.29,40.26 3.81,39.62 5.33,40.26 5.97,41.78 5.33,43.31 3.81,43.94 31.75,43.94 33.91,41.78 31.75,39.62 29.59,41.78 30.23,43.31 33.27,43.31 33.27,40.26 30.23,40.26 7.75,38.1 7.75,34.54 5.97,36.32 9.53,36.32 9.02,37.59 6.6,37.59 6.6,35.05 9.02,35.05 27.81,38.1 26.04,36.32 27.81,34.54 26.54,35.05 29.21,35.18 28.96,37.59 26.54,37.59 0.51,42.67 0.51,41.4 0.51,40.13 0.51,38.86 0.51,37.59 0.51,36.32 0.51,33.78 0.51,35.05 0.51,32.51 0.51,31.24 0.51,29.97 0.51,26.16 0.51,21.08 0.51,28.7 0.51,27.43 0.51,18.54 0.51,17.27 0.51,16 0.51,12.19 0.51,10.92 0.51,9.65 0.51,8.38 0.51,7.11 0.51,5.84 0.51,4.57 0.51,3.3 0.51,1.91 0.51,0.51 1.78,0.51 3.05,0.51 4.32,0.51 5.59,0.51 6.86,0.51 8.13,0.51 9.4,0.51 10.67,0.51 11.94,0.51 13.21,0.51 14.48,0.51 15.75,0.51 17.02,0.51 19.56,0.51 35.05,0.51 18.29,0.51 20.83,0.51 33.91,0.51 10.29,31.11 10.29,41.78 10.29,41.02 10.29,40.26 10.29,39.5 10.29,38.73 10.29,37.97 10.29,37.21 10.29,36.45 10.29,35.69 10.29,34.92 10.29,34.16 10.29,33.4 10.29,32.64 10.29,31.88 10.29,30.35 25.27,31.88 25.27,32.64 25.27,33.4 25.27,34.16 25.27,34.92 25.27,35.69 25.27,37.21 25.27,37.97 25.27,38.73 25.27,39.5 25.27,40.26 25.27,41.02 25.27,43.81 10.29,43.81 25.27,41.78 25.27,36.45 25.27,31.11 25.27,30.35 10.29,29.59 25.27,29.59 25.27,28.83 11.05,28.83 24.51,28.83 10.92,43.81 11.56,43.81 12.32,43.81 13.08,43.81 13.84,43.81 14.61,43.81 15.37,43.81 16.13,43.81 16.89,43.81 17.65,43.81 18.41,43.81 19.18,43.81 19.94,43.81 20.7,43.81 21.46,43.81 22.23,43.81 22.99,43.81 23.75,43.81 24.51,43.81 10.29,43.05 10.29,42.42 25.27,42.55 25.27,43.18 35.05,42.67 35.05,41.4 35.05,40.13 35.05,38.86 35.05,36.32 35.05,34.04 35.05,35.05 35.05,18.29 35.05,17.02 35.05,15.75 35.05,14.48 35.05,13.21 35.05,11.94 35.05,10.67 35.05,9.4 35.05,8.13 35.05,6.86 35.05,5.59 35.05,4.32 35.05,3.05 35.05,1.78 29.59,36.32 0.51,43.94 35.05,45.21 3.94,21.34 4.32,17.4 5.59,13.59 32.77,0.51 31.75,0.51 35.05,19.56 35.05,20.83 35.05,43.94 33.78,45.21 32.51,45.21 31.24,45.21 29.97,45.21 28.7,45.21 27.43,45.21 26.16,45.21 24.89,45.21 23.62,45.21 22.35,45.21 21.08,45.21 19.81,45.21 18.54,45.21 17.27,45.21 16,45.21 14.73,45.21 13.46,45.21 12.19,45.21 10.92,45.21 9.65,45.21 8.38,45.21 7.11,45.21 5.84,45.21 4.57,45.21 3.17,45.21 1.91,45.21 0.51,24.89 0.51,23.62 0.51,22.35 0.51,19.81 0.51,14.73 0.51,13.46 0.51,45.21 35.05,37.72 5.59,21.34 6.99,21.34 11.81,28.83 12.57,28.83 23.75,28.83 22.99,28.83 6.99,13.59 35.05,24.89 35.05,26.16 35.05,27.43 35.05,28.7 35.05,29.97 35.05,31.24 35.05,23.62 12.57,5.46 11.3,5.46 10.03,5.46 10.03,3.56 10.03,1.65 11.3,1.65 12.57,1.65 11.3,3.56 12.57,3.56 10.29,28.83 4.32,18.92 4.32,15.88 11.3,2.54 12.57,2.54 12.57,4.57 11.3,4.57 10.03,4.57
  pour GND (isolate 0.305): 0,0 0,46.35 35.56,46.35 35.56,0
  pour Top: 0,45.72 35.56,45.72 35.56,0 0,0 0,44.83 0.64,44.83 0.64,0.76 34.92,0.76 34.92,44.96 0,44.96
  pour Bottom: 0,45.72 35.56,45.72 35.56,0 0,0 0,44.83 0.64,44.83 0.64,0.76 34.92,0.76 34.92,44.96 0,44.96
  pour Top (isolate 0.305): 9.91,44.2 9.91,28.45 12.57,28.45 12.57,29.21 10.54,29.21 10.54,43.43 25.02,43.43 25.02,29.21 22.99,29.21 22.99,28.45 25.65,28.45 25.65,44.2
  pour Top (isolate 0.305): 3.81,21.34 7.37,21.34 7.37,13.59 3.81,13.59
  pour Bottom (isolate 0.305): 9.91,44.2 9.91,28.45 12.57,28.45 12.57,29.21 10.54,29.21 10.54,43.43 25.02,43.43 25.02,29.21 22.99,29.21 22.99,28.45 25.65,28.45 25.65,44.2
I2C1_SCL  (via drill 0.25)
  Top 0.127: U9.C2 16.07,37.17 arc90 15.72,37.52 14.66,37.52 arc90 v14.28,37.21 | v14.28,26.9 U12.95 arc90 U12.95
  Top 0.152: v14.28,30.79 RN7.2
  Bottom 0.127: v14.28,37.21 v14.28,30.79 v14.28,26.9
I2C1_SDA  (via drill 0.25)
  Top 0.127: U9.C1 arc-90 14.88,36.73 14.2,36.73 arc90 v13.79,36.35 | v13.79,25.98 13.79,24.88 arc-90 U12.96
  Top 0.152: U9.C1 | v13.79,29.97 RN7.1
  Bottom 0.127: v13.79,36.35 v13.79,29.97 v13.79,25.98
I2C2_SCL  (via drill 0.25)
  Top 0.152: U12.47 22.28,10.23 arc90 v21.97,10.54
  Bottom 0.152: v21.97,10.54 21.97,10.03 arc-90 20.45,8.51 3.17,8.51 arc-90 JP4.5
I2C2_SDA  (via drill 0.25)
  Top 0.152: U12.48 22.78,10.33 arc-90 v22.99,10.54
  Bottom 0.152: v22.99,10.54 22.99,10.41 arc-90 20.83,8 2.79,8 arc90 JP4.6
LED_B  (via drill 0.25)
  Top 0.152: v4.32,27.15 4.32,27.91 arc-90 RN4.7
  Top 0.203: U12.16 10.95,15.64 11.18,15.88 v11.43,15.88
  Bottom 0.203: v11.43,15.88 11.18,15.88 arc-90 9.83,17.22 9.83,21.82 arc90 8.05,23.72 6.04,23.72 arc-90 4.32,25.7 v4.32,27.15
LED_G  (via drill 0.25)
  Top 0.152: v3.56,27.15 3.56,27.91 arc90 RN4.6
  Top 0.203: U12.17 11.08,15.14 11.18,15.24 v11.43,15.24
  Bottom 0.203: v11.43,15.24 10.92,15.24 arc-90 9.27,16.89 9.27,21.54 arc90 7.59,23.11 6.04,23.11 arc-90 3.56,25.63 v3.56,27.15
LED_IR
  Top 0.203: U12.1 4.16,23.14 3.17,24.13 1.82,24.13 R5.1
LED_R  (via drill 0.25)
  Top 0.152: v5.08,27.15 5.08,27.87 arc-90 RN4.8
  Top 0.203: U12.15 10.81,16.14 11.18,16.51 v11.43,16.51
  Bottom 0.152: v11.43,16.51 11.38,16.51
  Bottom 0.203: v5.08,27.15 5.08,25.32 arc90 6.12,24.41 7.85,24.41 arc-90 10.41,22.1 10.41,17.53 arc90 v11.43,16.51
N$1
  Top 0.127: U9.C5 18.87,37.52 18.87,38.17 19.02,38.33 19.76,38.33 20.73,39.29 22.06,39.29 C17.1
N$2
  Top 0.203: C40.2 arc90 6.72,14.81 Y1.3 arc52 7.24,16.76 arc-41 8.26,17.14 U12.13
N$3
  Top 0.254: U9.A5 18.47,38.92 18.8,39.24 18.8,40.98 C16.1
N$4
  Top 0.203: C41.2 5.04,18.48 Y1.1 arc103 5.84,17.65 10.05,17.65 U12.12
N$5
  Top 0.406: Q1.1 1.8,22.37 R5.2
N$6
  Top 0.127: U9.F2 16.07,34.74 16.46,35.13 18.87,35.13 U9.F6
  Top 0.254: U9.F6 19.99,34.72 21.17,35.9 C15.1
N$7
  Top 0.305: X2.VBUS 25.12,5.58 25.78,6.25 U7.1
N$8
  Top 0.203: RN4.1 5.14,31 arc-90 LED1.R
N$9
  Top 0.203: LED1.G 2.99,31.3 arc-90 3.56,30.73 3.56,29.5 arc-90 RN4.3
N$10
  Top 0.406: R1.2 1.65,26.04 1.27,26.42 1.27,33.78 LED3.K
N$11
  Top 0.203: LED1.B 3.36,32.7 arc-90 4.32,31.75 4.32,29.5 arc90 RN4.2
N$12
  Top 0.305: U12.21 U12.22 9.34,12.64 9.14,12.45 9.14,12.06 8.8,11.72 C4.1
  Top 0.406: C4.1 C5.1 U3.1
N$13
  Top 0.127: U9.B3 16.48,38.31 16.48,39.78 16.11,40.15 15.86,40.15 15.58,40.42 C18.1
  Top 0.152: U9.B5 U9.B4 U9.B3
  Top 0.406: U6.1 15.54,41.06 C18.1
N$14
  Top 0.406: Q1.3 4.32,25.87 R1.1
N$15
  Top 0.152: X2.D- 25.77,5.04 arc-90 26.72,5.99 arc90 27.16,6.43 RN8.3
N$16
  Bottom 0.305: LED3.A 4.57,37.59 8.89,41.91 8.89,43.69 9.78,44.58 25.91,44.58 26.67,43.81 26.67,41.78 30.86,37.59 30.86,36.2 32,35.05 LED2.K
N$17
  Top 0.152: X2.D+ 26.42,4.72 arc-90 26.98,5.44 arc90 27.96,6.57 RN8.4
N$19  (via drill 0.25)
  Top 0.203: U12.55 22.8,13.14 v22.61,13.34
  Bottom 0.203: TP1.TP v22.61,13.34
N$20  (via drill 0.25)
  Top 0.203: U12.56 24.96,13.64 v24.51,14.1
  Bottom 0.203: TP2.TP v24.51,14.1
NRST  (via drill 0.25)
  Top 0.152: U12.14 10.68,16.64 11.43,17.4 14.61,17.4 16.64,15.37 v22.99,15.37
  Top 0.203: v29.59,24.38 28.86,24.38 RN5.7
  Bottom 0.152: v22.99,15.37 24.38,15.37 25.65,16.64 31.6,16.64 | v29.59,24.38 30.2,24.38 arc-90 31.6,22.91 31.6,16.64 | JP3.4 arc-90 31.6,14.38 31.6,16.64
RAW  (via drill 0.6)
  Top 0.813: v20.32,2.16 D2.2
  Bottom 0.61: J3.2
  Bottom 0.813: J4.2 J3.2 | JP3.7 J3.2 | J3.2 25.91,4.83 24.89,3.81 21.21,3.81 20.32,2.92 v20.32,2.16
SD_CD  (via drill 0.25)
  Top 0.152: v23.29,26.72 23.29,24.88 arc-90 U12.77 | RN6.8 arc-90 RN6.8 arc90 RN6.8 | RN6.8 v29.59,32.69 30.33,32.69 30.73,32.28 31.47,32.28 32.21,31.55 34.39,31.55 34.92,32.07 U2.G$5
  Bottom 0.152: v29.59,32.69 arc-90 30.53,31.83 30.53,30.63 arc-90 27.05,27.15 23.72,27.15 arc90 v23.29,26.72
SDIO_CLK  (via drill 0.25)
  Top 0.152: v21.77,26.01 21.77,24.88 arc90 U12.80 | v30.2,26.77 31.13,26.77 arc90 U2.P$5
  Bottom 0.152: v21.77,26.01 21.77,25.96 arc90 22.17,25.55 23.39,25.55 arc90 23.98,26.14 arc-90 24.56,26.7 30.15,26.7 arc90 30.2,26.75 v30.2,26.77
SDIO_CMD
  Top 0.152: U2.P$3 30.48,29 arc-90 29.9,29.59 arc90 29.19,30.3 RN6.5 arc-90 28.14,29.59 27.05,29.59 arc90 26.16,28.7 26.16,28.68 arc-90 25.45,27.81 22,27.81 arc90 20.3,26.11 20.3,24.88 arc-90 U12.83
SDIO_D0  (via drill 0.25)
  Top 0.152: v26.8,18.14 U12.65 arc-90 U12.65 | U2.P$7 30.7,24.61 arc90 30.18,24.08 arc-99 v29.59,23.62 28.86,23.62 arc90 RN5.6
  Bottom 0.152: v29.59,23.62 arc-90 30.12,23.09 30.12,21.13 arc-90 27.13,18.14 v26.8,18.14
SDIO_D1  (via drill 0.25)
  Top 0.152: v26.34,18.67 25.52,18.67 arc90 U12.66 | RN5.5 arc-90 28.9,22.86 v29.59,22.86 30,22.86 arc90 30.38,23.24 arc-90 30.64,23.5 U2.P$8
  Top 0.203: 28.9,22.86 RN5.5
  Bottom 0.152: v29.59,22.86 29.59,21.57 arc-90 26.7,18.67 v26.34,18.67
SDIO_D2  (via drill 0.25)
  Top 0.152: v22.78,26.11 U12.78 arc-90 U12.78 | U2.P$1 30.47,31.2 arc-90 30.15,31.5 arc90 29.67,31.9 v29.59,31.9 RN6.7 arc90 RN6.7
  Bottom 0.152: v29.59,31.9 arc-90 30.1,31.37 30.1,30.84 arc-90 26.87,27.61 23.52,27.61 arc90 22.78,26.87 v22.78,26.11
SDIO_D3  (via drill 0.25)
  Top 0.152: v22.28,26.7 U12.79 arc90 U12.79 | U2.P$2 30.47,30.11 arc-90 30.02,30.66 arc93 v29.59,31.09 RN6.6 arc-90 RN6.6
  Bottom 0.152: v29.59,31.09 arc-90 26.62,28.12 23.04,28.12 arc90 22.28,27.36 v22.28,26.7
SPI2_MISO  (via drill 0.25)
  Top 0.152: U12.53 11.26,12.14 arc90 v11.05,11.94
  Bottom 0.152: JP4.2 2.77,17.53 arc-90 3.35,16.94 3.35,13.89 arc90 5.3,11.94 v11.05,11.94
SPI2_MOSI  (via drill 0.25)
  Top 0.152: U12.54 11.31,12.64 arc-90 v11.05,12.9
  Bottom 0.152: JP4.1 2.9,20.07 arc-90 3.79,19.18 3.79,14.15 arc90 5.03,12.9 v11.05,12.9
SPI2_NSS
  Top 0.152: U12.51 12.72,11.14 arc90 11.28,9.93 arc-90 9.37,8.03 4.75,8.03 arc-90 3.28,9.53 3.28,11.46 arc90 2.39,12.45 JP4.4
SPI2_SCLK
  Top 0.152: U12.52 12.38,11.64 arc90 10.69,10.16 10.69,10.11 arc-90 9.09,8.56 5.05,8.56 arc-90 3.81,9.73 3.81,13.64 arc90 2.46,14.99 JP4.3
SWCLK  (via drill 0.25)
  Top 0.152: U12.76 24.2,24.86 arc90 v24.38,25.04
  Bottom 0.152: JP3.1 arc-90 32.72,20.88 32.72,23.19 arc90 30.3,25.65 25.02,25.65 arc90 v24.38,25.04
SWDIO
  Top 0.203: U12.72 25.9,21.64 arc-90 28.78,18.77 arc90 30.02,17.53 JP3.2
TIM4_CH1  (via drill 0.25)
  Top 0.203: U12.59 26.38,15.14 arc-90 v26.54,14.99
  Bottom 0.203: JP3.6 J3.3 29.31,7.37 arc-90 28.73,7.95 28.73,13.59 arc90 27.33,14.99 v26.54,14.99
TIM4_CH2  (via drill 0.25)
  Top 0.203: U12.60 26.31,15.64 arc90 v26.54,15.88
  Bottom 0.203: JP3.5 arc90 31.98,11.46 31.77,11.46 arc-90 30.35,12.88 J4.3 30.35,15.65 arc90 29.9,16.1 26.77,16.1 arc90 v26.54,15.88
VBUS  (via drill 0.5, 0.6)
  Top 0.254: v25.78,10.03 27.3,11.56 27.3,18.92 26.58,19.64 U12.68
  Top 0.61: v18.54,2.16 D1.2 | U7.2 v25.78,10.03
  Bottom 0.61: v25.78,10.03 25.78,6.86 24.38,5.46 20.32,5.46 18.54,3.68 v18.54,2.16
VCAP1  (via drill 0.33)
  Top 0.305: v20.57,6.48 20.74,6.64 C49.1 20.7,7.53 20.7,8.13 21.08,8.51 22.99,8.51 23.28,8.8 U12.49
VCAP2
  Top 0.305: U12.73 27.77,22.14 28.19,21.72 | 28.19,21.72 | 28.19,21.72 C48.1
VCC  (via drill 0.25, 0.33, 0.41, 0.7)
  Top 0.254: RN6.1 26.61,32.7 v26.42,32.89 | RN6.2 26.65,31.9 v26.42,32.13 | RN6.3 26.56,31.1 v26.42,31.24 | RN6.4 26.6,30.3 v26.42,30.48 | U12.6 10.85,20.64 11.18,20.32 v11.3,20.32 | RN5.4 26.61,22.8 v26.54,22.73 | RN5.3 26.65,23.6 v26.54,23.5 | RN5.2 26.69,24.4 v26.54,24.26 | C13.1 v8.26,18.92 9.03,18.14 U12.11
  Top 0.305: U12.75 25.53,23.17 v25.53,23.88 C9.1 | U12.28 12.78,8.68 13.21,8.26 13.21,7.53 C7.1 13.25,6.64 v13.08,6.48 | v23.88,6.48 24.04,6.64 C8.1 24.04,8.34 23.78,8.61 U12.50 | v11.43,14.48 11.05,14.48 10.72,14.14 U12.19 9.48,14.14 8.64,14.99 8.29,14.99 C14.1 | U12.100 11.75,24.89 11.56,24.89
  Top 0.406: U8.3 22.61,30.16 v22.61,31.11 22.61,32.06 U8.1 19.71,32.06 C23.1 | U3.2 v4.95,9.14 | C1.1 27.28,28.36 C10.1 29.93,28.36 30.39,27.91 U2.P$4 31.2,27.94 v32.26,27.94 | v11.48,31.47 RN7.3 RN7.4 | LED1.A 6.54,32.7 v6.73,32.51 | v6.73,25.15 7,24.88 C11.2 9.93,24.88 C6.1 10.12,24.89 11.56,24.89
  Top 0.813: U1.2 U1.1 6.35,5.46 C3.1 v6.1,6.99
  pour VCC (isolate 0.305): 0,0 0,46.35 35.56,46.35 35.56,0
VIN
  Top 0.813: 16.76,5.47 D1.1 D2.1 | 16.76,5.47 15.49,5.47 | 15.49,5.47 U1.8 | 16.76,5.47 16.89,5.34 16.76,5.21 C2.1 | U1.5 15.49,1.65 15.49,5.47

### Text on the board
tPlace: MOSI | SWC | SWD | MISO | SCK | BOOT | SEL | RST | TXD | PWM2 | RXD | PWM1 | DAC | VCC | VOUT | GND
bPlace: penMV